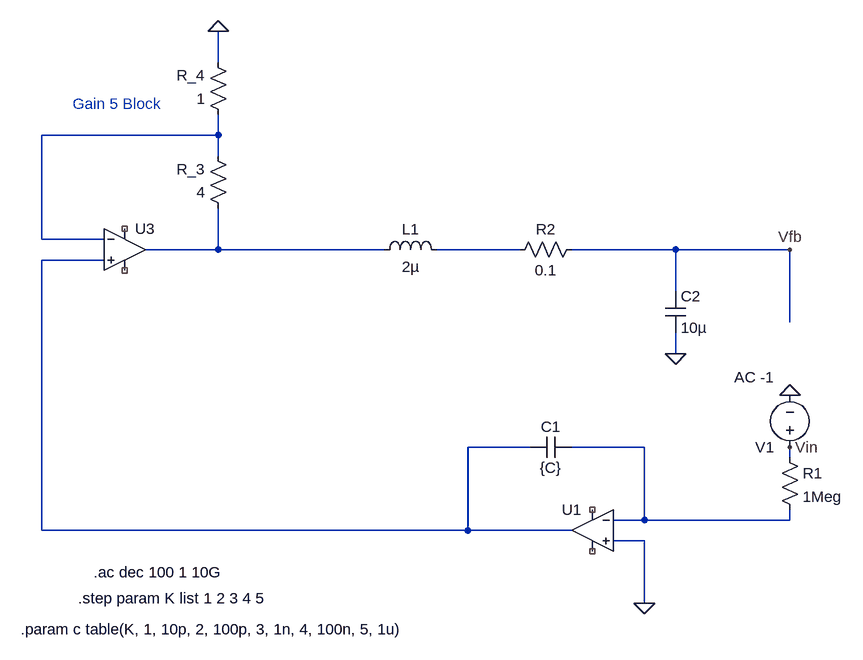
[diagram p0: schematic tut7ques8a1.asc]
tut7ques8a1.asc, the LTspice schematic file:
Version 4
SHEET 1 880 680
WIRE -528 -544 -528 -592
WIRE -528 -432 -528 -464
WIRE -528 -432 -800 -432
WIRE -528 -400 -528 -432
WIRE -800 -272 -800 -432
WIRE -704 -272 -800 -272
WIRE -528 -256 -528 -320
WIRE -528 -256 -640 -256
WIRE -272 -256 -528 -256
WIRE -64 -256 -192 -256
WIRE 176 -256 16 -256
WIRE 352 -256 176 -256
WIRE -704 -240 -800 -240
WIRE 176 -192 176 -256
WIRE 352 -144 352 -256
WIRE 176 -96 176 -128
WIRE -48 48 -144 48
WIRE 128 48 16 48
WIRE 352 64 352 48
WIRE 128 160 128 48
WIRE 128 160 80 160
WIRE 352 160 352 144
WIRE 352 160 128 160
WIRE -800 176 -800 -240
WIRE -144 176 -144 48
WIRE -144 176 -800 176
WIRE 16 176 -144 176
WIRE 128 192 80 192
WIRE 128 288 128 192
FLAG 128 288 0
FLAG 176 -96 0
FLAG 352 -32 0
FLAG -528 -592 0
FLAG 352 -256 Vfb
FLAG 352 48 Vin
SYMBOL res 336 48 R0
SYMATTR InstName R1
SYMATTR Value 1Meg
SYMBOL voltage 352 64 R180
WINDOW 123 24 124 Left 2
WINDOW 39 0 0 Left 0
SYMATTR Value2 AC -1
SYMATTR InstName V1
SYMATTR Value ""
SYMBOL cap 16 32 R90
WINDOW 0 0 32 VBottom 2
WINDOW 3 32 32 VTop 2
SYMATTR InstName C1
SYMATTR Value {C}
SYMBOL ind -288 -240 R270
WINDOW 0 32 56 VTop 2
WINDOW 3 5 56 VBottom 2
SYMATTR InstName L1
SYMATTR Value 2µ
SYMBOL res 32 -272 R90
WINDOW 0 0 56 VBottom 2
WINDOW 3 32 56 VTop 2
SYMATTR InstName R2
SYMATTR Value 0.1
SYMBOL cap 160 -192 R0
SYMATTR InstName C2
SYMATTR Value 10µ
SYMBOL OpAmps\\UniversalOpAmp 48 176 M0
SYMATTR InstName U1
SYMBOL res -512 -304 R180
WINDOW 0 36 76 Left 2
WINDOW 3 36 40 Left 2
SYMATTR InstName R_3
SYMATTR Value 4
SYMBOL res -512 -448 R180
WINDOW 0 36 76 Left 2
WINDOW 3 36 40 Left 2
SYMATTR InstName R_4
SYMATTR Value 1
SYMBOL OpAmps\\UniversalOpAmp -672 -256 R0
SYMATTR InstName U3
TEXT -720 240 Left 2 !.ac dec 100 1 10G
TEXT -752 -480 Left 2 ;Gain 5 Block
TEXT -744 280 Left 2 !.step param K list 1 2 3 4 5
TEXT -832 328 Left 2 !.param c table(K, 1, 10p, 2, 100p, 3, 1n, 4, 100n, 5, 1u)

The netlist it stands for:
* tut7ques8a1.asc
R1 Vin N005 1Meg
V1 Vin 0 AC -1
C1 N005 N004 {C}
L1 N002 N003 2µ
R2 Vfb N003 0.1
C2 Vfb 0 10µ
XU1 0 N005 NC_01 NC_02 N004 level1 Avol=1Meg GBW=10Meg Vos=0 En=0 Enk=0 In=0 Ink=0 Rin=500Meg  ; pins In+ In- V+ V- OUT
R_3 N002 N001 4
R_4 N001 0 1
XU3 N004 N001 NC_03 NC_04 N002 level1 Avol=1Meg GBW=10Meg Vos=0 En=0 Enk=0 In=0 Ink=0 Rin=500Meg  ; pins In+ In- V+ V- OUT
.ac dec 100 1 10G
* Gain 5 Block
.step param K list 1 2 3 4 5
.param c table(K, 1, 10p, 2, 100p, 3, 1n, 4, 100n, 5, 1u)
.lib UniversalOpAmp1.lib
.backanno
.end